# EasyEDA Pro project MSDRV4.eprj, board PCB10
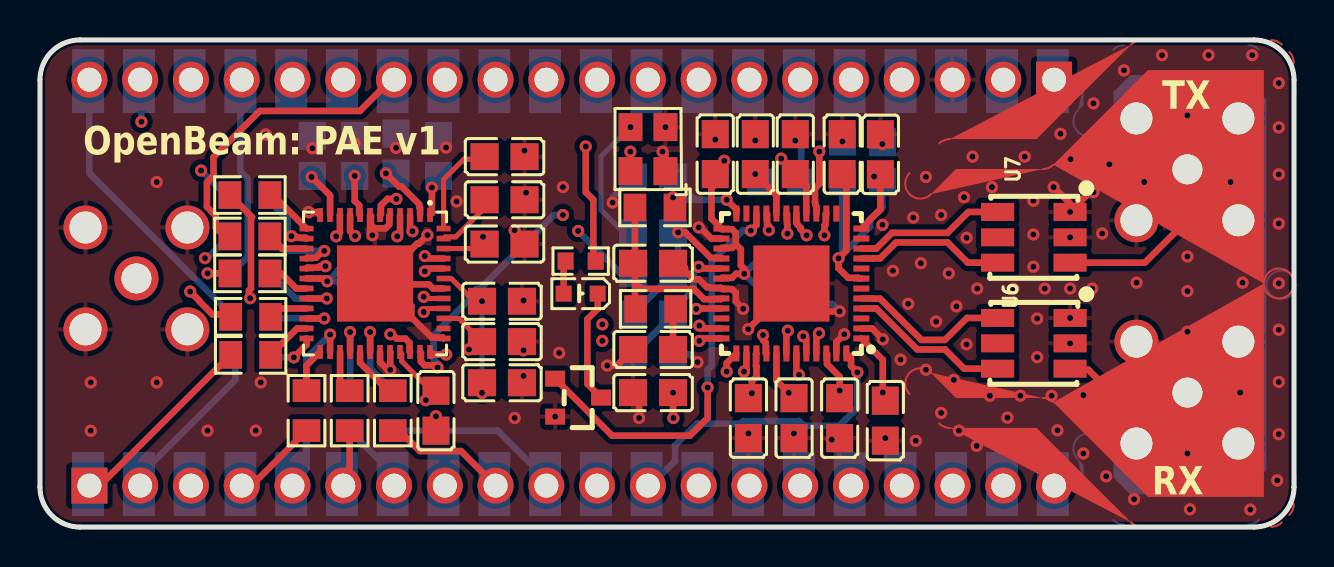
[diagram p4: board, top side]
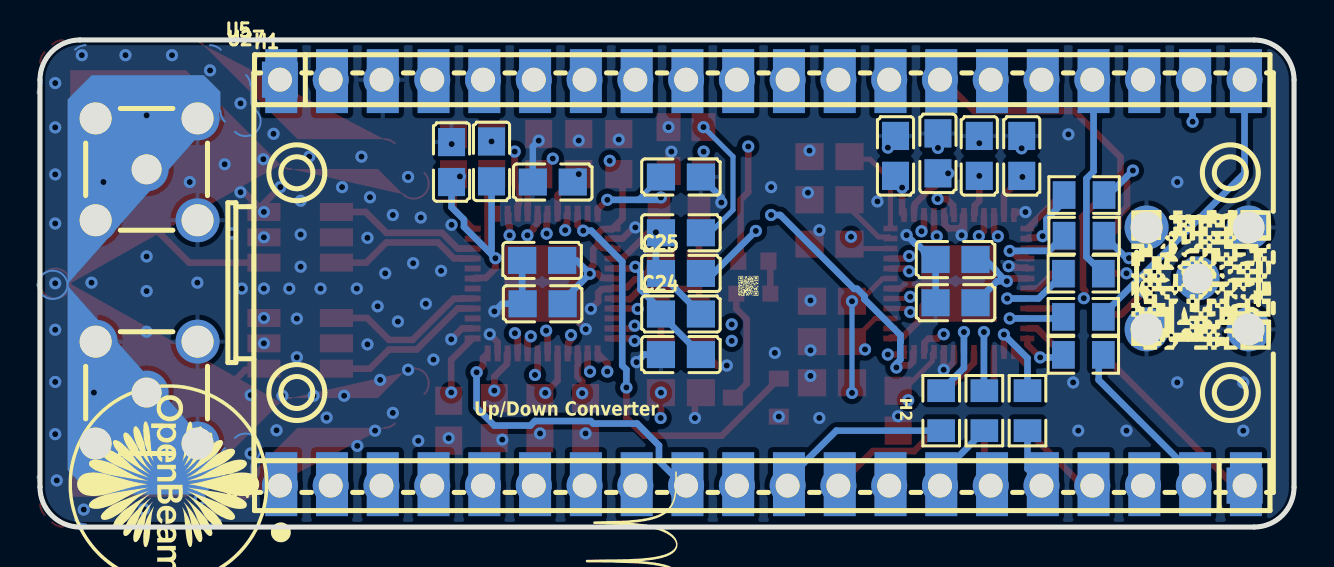
[diagram p5: board, bottom side, seen from below]

Outline 62.74 x 24.38 mm; copper layers: Top Layer, GND, Inner2, Inner3, 3.3, Bottom Layer. Coordinates in mm from the lower left corner of the outline.
Outline path: 0,22.38 0,2 arc(0.59,0.59) 2,0 60.74,0 arc(62.15,0.59) 62.74,2 62.74,22.38 arc(62.15,23.8) 60.74,24.38 2,24.38 arc(0.59,23.8) 0,22.38
Stack: Top Layer 0.035mm Outer layer thickness 1oz / Dielectric1 0.0994mm 3313 RC57% 4.2mil / GND 0.0152mm Inner layer thickness / Dielectric2 0.55mm 0.55mm H/H No copper / Inner2 0.0152mm Inner layer thickness / Dielectric3 0.1088mm 2116 RC54% 4.9mil / Inner3 0.0152mm Inner layer thickness / Dielectric4 0.55mm 0.55mm H/H No copper / 3.3 0.0152mm Inner layer thickness / Dielectric5 0.0994mm 3313 RC57% 4.2mil / Bottom Layer 0.035mm Outer layer thickness 1oz

## Design rules (mm)
net $1I297\RXP: $1I297\RX
net $1I297\RXN: $1I297\RX
net $1I297\TXP: $1I297\TX
net $1I297\TXN: $1I297\TX
net RXQN: RXQ
net RXQP: RXQ
net RXIN: RXI
net RXIP: RXI
net TXQN: TXQ
net TXQP: TXQ
net TXIN: TXI
net TXIP: TXI
template: JLCPCB Capability(Two Layers Board)
spacing copperThickness1oz (default): track to track 0.102, other pairs 0.152 to 0.3
spacing copperThickness2oz: track to track 0.203, other pairs 0.152 to 0.3
track width copperThickness1oz (default): min 0.127, default 0.254, max 2.54
track width copperThickness2oz: min 0.203, default 0.254, max 2.54
differential pair differentialPair (default): width min 0.127, default 0.254, max 2.54; gap min 0.152, default 0.152
via viaSize (default): diameter min 0.5, default 0.61, max 10; hole min 0.3, default 0.305, max 6.3

## Placement (name value [footprint] x y rotation side)
C18  100nF  [C0805]  30.67 6.73 0 top
C19  1nF  [C0805]  30.67 14.73 0 bottom
C20  100pF  [C0805]  30.67 17.52 0 bottom
C21  2200pF  [C0805]  30.67 8.89 0 top
C22  68pF  [C0805]  30.67 13.21 180 top
C23  18pF  [C0805]  30.67 8.63 0 bottom
C24  100nF  [C0805]  30.67 10.67 180 bottom
C25  100nF  [C0805]  30.67 12.7 180 bottom
C26  330nF  [C0805]  19.94 18.58 270 bottom
C28  100nF  [C0805]  23.11 11.3 180 top
C30  100nF  [C0805]  17.81 18.71 90 bottom
C31  100nF  [C0805]  13.62 18.58 270 bottom
C32  100nF  [C0805]  15.75 18.58 270 bottom
C33  100nF  [C0805]  23.11 9.28 0 top
C35  330nF  [C0805]  23.24 18.54 0 top
C36  100nF  [C0805]  23.11 7.22 180 top
C37  330nF  [C0805]  23.24 16.38 180 top
C38  100nF  [C0805]  23.24 14.17 180 top
C39  100nF  [C0805]  16.93 11.23 180 bottom
C40  100nF  [C0805]  19.81 5.83 90 top
C41  100nF  [C0805]  16.93 13.39 180 bottom
CLNA1  100pF  [C0805]  42.29 5.33 270 top
CPA1  10uF  [C0805]  40.15 18.3 90 bottom
CPA2  10uF  [C0805]  42.15 18.27 90 bottom
CPA3  100nF  [C0805]  42.05 18.66 90 top
CPLL1  100pF  [C0805]  37.79 18.67 90 top
CRXMX1  100pF  [C0805]  40.01 5.45 270 top
CTXMX1  100pF  [C0805]  40.13 18.67 90 top
CVCCCP1  10nF  [C0805]  35.78 18.67 90 top
CVCO0  100pF  [C0805]  37.59 11.18 0 bottom
CVCO1  100pF  [C0805]  37.62 13.35 0 bottom
CVCO2  100pF  [C0805]  37.08 17.27 0 bottom
CVRXA1  100pF  [C0805]  35.44 5.45 270 top
CVRXF1  100pF  [C0805]  37.72 5.45 270 top
CVXTAL1  100pF  [C0805]  33.78 18.67 90 top
H1  -  [HDR-TH_20P-P2.54-V-M-1]  26.6 22.39 180 bottom
H2  -  [HDR-TH_20P-P2.54-V-M-1]  26.6 2.07 0 bottom
LED1  -  [LED0603-R-RD]  27.05 11.68 180 top
NOREF  -  [Pad_e387]  53.01 2.87 0 top
NOREF#2  -  [Pad_e1126]  62.1 6.48 0 top
NOREF#3  -  [Pad_e1119]  62.1 17.77 0 top
NOREF#4  -  [Pad_e386]  53.01 21.51 0 top
Q1  -  [SOT-23_L2.9-W1.3-P1.90-LS2.4-BR]  26.92 6.48 180 top
R1  10K  [R0603]  27.05 13.31 0 top
RDA0  100  [R0805]  10.5 16.62 180 top
RDA1  100  [R0805]  10.5 16.62 180 bottom
RDA2  100  [R0805]  10.5 14.54 180 top
U1  MCX5.08-H5  [SMA-TH_MCX5.08-H5]  4.83 12.45 180 bottom
U2  MAX5864ETM+  [QFN-48_L7.0-W7.0-P0.50-BL-EP5.1]  16.76 12.19 180 top
U3  MAX2831ETM+T  [TQFN-48_L7.0-W7.0-P0.50-TL-EP5.6]  37.59 12.19 180 top
U4  MCX5.08-H5  [SMA-TH_MCX5.08-H5]  57.4 6.73 0 bottom
U5  MCX5.08-H5  [SMA-TH_MCX5.08-H5]  57.4 17.91 0 bottom
U6  TCM2-43X+  [IND-SMD_6P-L4.1-W3.8-P1.27-TL]  49.72 9.2 270 top
U7  TCM2-43X+  [IND-SMD_6P-L4.1-W3.8-P1.27-TL]  49.72 14.5 270 top
U8  1.2K  [R0805]  30.8 10.92 0 top
U9  750  [R0805]  30.77 16 0 top
U11  100  [R0805]  17.65 5.83 90 bottom
U12  100  [R0805]  17.65 5.83 90 top
U13  100  [R0805]  15.49 5.83 90 bottom
U14  100  [R0805]  15.49 5.83 90 top
U15  100  [R0805]  13.33 5.83 90 bottom
U16  100  [R0805]  13.33 5.83 90 top
U17  100  [R0805]  10.54 8.62 180 bottom
U18  100  [R0805]  10.54 8.62 180 top
U19  100  [R0805]  10.54 10.52 180 bottom
U20  100  [R0805]  10.54 10.52 180 top
U21  100  [R0805]  10.54 12.68 180 bottom
U22  100  [R0805]  10.5 12.7 180 top
U23  100  [R0805]  10.5 14.59 180 bottom
U27  PICO  [comm-smd_l51.0-w21.0-p2.54_sc0916]  26.22 12.23 180 bottom
X1  40MHz  [OSC-SMD_4P-L3.2-W2.5-BL]  30.42 18.92 90 top

## Footprints (pads in the part's own frame, mm; a bottom-side part is the same pattern mirrored in y, then rotated)
C0805
  rect 1.41x1.35 smd: 1(-1,0) 2(1,0)
comm-smd_l51.0-w21.0-p2.54_sc0916
  rect 1.6x3.2 smd: 1(-24.445,-10.088) 2(-21.905,-10.088) 3(-19.365,-10.088) 4(-16.825,-10.088) 5(-14.285,-10.088) 6(-11.745,-10.088) 7(-9.205,-10.088) 8(-6.665,-10.088) 9(-4.125,-10.088) 10(-1.585,-10.088) 11(0.955,-10.088) 12(3.495,-10.088) 13(6.035,-10.088) 14(8.575,-10.088) 15(11.115,-10.088) 16(13.655,-10.088) 17(16.195,-10.088) 18(18.735,-10.088) 19(21.275,-10.088) 20(23.815,-10.088) 21(23.815,10.088) 22(21.275,10.088) 23(18.735,10.088) 24(16.195,10.088) 25(13.655,10.088) 26(11.115,10.088) 27(8.575,10.088) 28(6.035,10.088) 29(3.495,10.088) 30(0.955,10.088) 31(-1.585,10.088) 32(-4.125,10.088) 33(-6.665,10.088) 34(-9.205,10.088) 35(-11.745,10.088) 36(-14.285,10.088) 37(-16.825,10.088) 38(-19.365,10.088) 39(-21.905,10.088) 40(-24.445,10.088)
HDR-TH_20P-P2.54-V-M-1
  rect 1.8x1.8 hole 1.2: 1(-24.13,0)
  round 1.8 hole 1.2: 2(-21.59,0) 3(-19.05,0) 4(-16.51,0) 5(-13.97,0) 6(-11.43,0) 7(-8.89,0) 8(-6.35,0) 9(-3.81,0) 10(-1.27,0) 11(1.27,0) 12(3.81,0) 13(6.35,0) 14(8.89,0) 15(11.43,0) 16(13.97,0) 17(16.51,0) 18(19.05,0) 19(21.59,0) 20(24.13,0)
IND-SMD_6P-L4.1-W3.8-P1.27-TL
  rect 0.9x1.657 smd: 1(-1.27,1.813) 2(0,1.813) 3(1.27,1.813) 4(1.27,-1.813) 5(0,-1.813) 6(-1.27,-1.813)
LED0603-R-RD
  rect 0.8x0.8 smd: 1(0.851,0) 2(-0.851,0)
OSC-SMD_4P-L3.2-W2.5-BL
  rect 1.4x1.2 smd: 1(-1.1,-0.875) 2(1.1,-0.875) 3(1.1,0.875) 4(-1.1,0.875)
Pad_e386
  custom 19.439x12.93 smd: 50(0,0)
Pad_e387
  custom 19.439x12.93 smd: 51(0,0)
Pad_e1119
  custom 11.152x12.7 smd far side: 52(0,0)
Pad_e1126
  custom 11.152x12.7 smd far side: 53(0,0)
QFN-48_L7.0-W7.0-P0.50-BL-EP5.1
  rect 0.28x0.7 smd: 1(-2.75,-3.428) 2(-2.25,-3.428) 3(-1.75,-3.428) 4(-1.25,-3.428) 5(-0.75,-3.428) 6(-0.25,-3.428) 7(0.25,-3.428) 8(0.75,-3.428) 9(1.25,-3.428) 10(1.75,-3.428) 11(2.25,-3.428) 12(2.75,-3.428) 25(2.75,3.428) 26(2.25,3.428) 27(1.75,3.428) 28(1.25,3.428) 29(0.75,3.428) 30(0.25,3.428) 31(-0.25,3.428) 32(-0.75,3.428) 33(-1.25,3.428) 34(-1.75,3.428) 35(-2.25,3.428) 36(-2.75,3.428)
  rect 0.7x0.28 smd: 13(3.428,-2.75) 14(3.428,-2.25) 15(3.428,-1.75) 16(3.428,-1.25) 17(3.428,-0.75) 18(3.428,-0.25) 19(3.428,0.25) 20(3.428,0.75) 21(3.428,1.25) 22(3.428,1.75) 23(3.428,2.25) 24(3.428,2.75) 37(-3.428,2.75) 38(-3.428,2.25) 39(-3.428,1.75) 40(-3.428,1.25) 41(-3.428,0.75) 42(-3.428,0.25) 43(-3.428,-0.25) 44(-3.428,-0.75) 45(-3.428,-1.25) 46(-3.428,-1.75) 47(-3.428,-2.25) 48(-3.428,-2.75)
  rect 3.81x3.81 smd: 49(0,0)
R0603
  rect 0.806x0.864 smd: 1(-0.753,0) 2(0.753,0)
R0805
  rect 1.133x1.377 smd: 1(-1,0) 2(1,0)
SMA-TH_MCX5.08-H5
  round 2.2 hole 1.6: 1(-2.55,-2.55) 2(-2.55,2.55) 3(2.55,2.55) 4(2.55,-2.55)
  round 2.2 hole 1.5: 5(0,0)
SOT-23_L2.9-W1.3-P1.90-LS2.4-BR
  rect 1x0.8 smd: 1(1.15,-0.95) 2(1.15,0.95) 3(-1.15,0)
TQFN-48_L7.0-W7.0-P0.50-TL-EP5.6
  rect 0.8x0.3 smd: 1(-3.5,2.751) 2(-3.5,2.251) 3(-3.5,1.75) 4(-3.5,1.251) 5(-3.5,0.75) 6(-3.5,0.252) 7(-3.5,-0.249) 8(-3.5,-0.75) 9(-3.5,-1.25) 10(-3.5,-1.75) 11(-3.5,-2.249) 12(-3.5,-2.748) 25(3.5,-2.748) 26(3.5,-2.249) 27(3.5,-1.75) 28(3.5,-1.25) 29(3.5,-0.75) 30(3.5,-0.249) 31(3.5,0.252) 32(3.5,0.75) 33(3.5,1.251) 34(3.5,1.75) 35(3.5,2.251) 36(3.5,2.751)
  rect 0.3x0.8 smd: 13(-2.751,-3.5) 14(-2.251,-3.5) 15(-1.75,-3.5) 16(-1.25,-3.5) 17(-0.75,-3.5) 18(-0.251,-3.5) 19(0.249,-3.5) 20(0.75,-3.5) 21(1.25,-3.5) 22(1.75,-3.5) 23(2.251,-3.5) 24(2.751,-3.5) 37(2.751,3.5) 38(2.251,3.5) 39(1.75,3.5) 40(1.25,3.5) 41(0.75,3.5) 42(0.251,3.5) 43(-0.251,3.5) 44(-0.75,3.5) 45(-1.25,3.5) 46(-1.75,3.5) 47(-2.251,3.5) 48(-2.751,3.5)
  rect 3.81x3.81 smd: 49(0,0.001)

## Nets
+5V: H1.1 R1.2 U27.40
GND: C18.1 C20.1 C21.1 C22.1 C23.2 C26.1 C28.1 C30.2 C31.1 C32.1 C33.2 C35.2 C36.1 C37.1 C38.1 C39.1 C40.1 C41.1 CLNA1.2 CPA1.2 CPA2.2 CPA3.2 CPLL1.2 CRXMX1.2 CTXMX1.2 CVCCCP1.2 CVCO0.2 CVCO1.2 CVCO2.2 CVRXA1.2 CVRXF1.2 CVXTAL1.2 H1.3 NOREF.51 NOREF#2.53 NOREF#3.52 NOREF#4.50 Q1.2 U1.1 U1.2 U1.3 U1.4 U2.5 U2.7 U2.12 U2.17 U2.31 U2.32 U2.37 U2.42 U2.49 U3.2 U3.26 U3.31 U3.47 U3.49 U4.1 U4.2 U4.3 U4.4 U5.1 U5.2 U5.3 U5.4 U6.1 U6.2 U7.1 U7.2 U27.38 X1.1 X1.2
3.3: C28.2 C30.1 C31.2 C32.2 C33.1 C36.2 C38.2 C39.2 C40.2 C41.2 CLNA1.1 CPA1.1 CPA2.1 CPA3.1 CPLL1.1 CRXMX1.1 CTXMX1.1 CVCCCP1.1 CVCO0.1 CVCO1.1 CVCO2.1 CVRXA1.1 CVRXF1.1 CVXTAL1.1 H1.5 U2.2 U2.8 U2.11 U2.18 U2.33 U2.39 U2.43 U2.46 U3.1 U3.7 U3.12 U3.13 U3.17 U3.20 U3.25 U3.27 U3.30 U3.39 U3.40 U3.41 U3.46 U27.36 X1.4
$1I61\$1N1602: C37.2 U2.47
$1I61\$1N1605: U2.30 U11.2
$1I61\$1N1608: U2.29 U12.2
$1I61\$1N1611: U2.28 U13.2
$1I61\$1N1614: U2.27 U14.2
$1I61\$1N1617: U2.26 U15.2
$1I61\$1N1620: U2.25 U16.2
$1I61\$1N1625: U2.24 U17.1
$1I61\$1N1628: U2.23 U18.1
$1I61\$1N1633: U2.21 U20.1
$1I61\$1N1636: U2.20 U21.1
$1I61\$1N1639: U2.19 U22.1
$1I61\$1N1642: U2.16 U23.1
$1I61\$1N1645: RDA2.1 U2.15
$1I61\$1N1648: RDA1.1 U2.14
$1I61\$1N1651: RDA0.1 U2.13
$1I61\$1N1653: C35.1 U2.48
$1I61\$1N1654: C26.2 U2.1
$1I61\$1N1662: U2.22 U19.1
$1I297\$1N1513: U4.5 U6.3
$1I297\$1N1514: U5.5 U7.3
$1I297\$1N1515: C21.2 U8.2
$1I297\$1N2254: C23.1 C24.1 U3.29
$1I297\$1N2490: C19.1 X1.3
$1I297\BYPASS: C18.2 U3.33
$1I297\CPOUT: C20.2 U3.24 U9.2
$1I297\D1: U3.23
$1I297\D2: U3.11
$1I297\D3: U3.8
$1I297\D4: U3.34
$1I297\D5: U3.14
$1I297\D6: U3.3
$1I297\D7: U3.6
$1I297\RXN: U3.5 U6.6
$1I297\RXP: U3.4 U6.4
$1I297\TUNE: C22.2 U3.32 U8.1 U9.1
$1I297\TXN: U3.10 U7.6
$1I297\TXP: U3.9 U7.4
$1I297\XTAL: C19.2 C24.2 C25.1 U3.28
BBC_CLK: H1.10 U2.6 U27.31
BBC_DA0: H2.11 RDA0.2 U27.10
BBC_DA1: H1.12 RDA1.2 U27.29
BBC_DA2: H1.14 RDA2.2 U27.27
BBC_DA3: H1.15 U23.2 U27.26
BBC_DA4: H1.16 U22.2 U27.25
BBC_DA5: H1.17 U21.2 U27.24
BBC_DA6: H1.19 U20.2 U27.22
BBC_DA7: H1.20 U19.2 U27.21
BBC_DD0: H2.1 U18.2 U27.20
BBC_DD1: H2.2 U17.2 U27.19
BBC_DD2: H2.4 U16.1 U27.17
BBC_DD3: H2.5 U15.1 U27.16
BBC_DD4: H2.6 U14.1 U27.15
BBC_DD5: H2.7 U13.1 U27.14
BBC_DD6: H2.9 U12.1 U27.12
BBC_DD7: H2.10 U11.1 U27.11
RXIN: U2.4 U3.37
RXIP: U2.3 U3.38
RXQN: U2.9 U3.35
RXQP: U2.10 U3.36
TXIN: U2.44 U3.44
TXIP: U2.45 U3.45
TXQN: U2.41 U3.42
TXQP: U2.40 U3.43
$1N2356: H2.3 U27.18
$1N2366: H2.8 U27.13
$1N2372: H2.13 U27.8
$1N2374: H2.18 U27.3
$1N2378: H1.2 U27.39
$1N2382: H1.4 U27.37
$1N2386: H1.6 U27.35
$1N2388: H1.7 U3.16 U27.34
$1N2390: H1.8 U27.33
$1N2392: C25.2 H1.9 U1.5 U27.32
$1N2396: H1.11 U27.30
$1N2400: H1.13 U27.28
$1N2410: H1.18 U27.23
$1N2418: H2.12 U3.48 U27.9
$1N2420: H2.14 U3.21 U27.7
$1N2424: H2.16 U2.34 U3.19 U27.5
$1N2426: H2.17 U2.35 U3.18 U27.4
$1N2428: H2.19 U2.36 U27.2
$1N2430: H2.20 U3.15 U27.1
$1N4492: Q1.1 U3.22
$1N4497: H2.15 U27.6
$1N4593: LED1.2 Q1.3
$1N4646: LED1.1 R1.1

Pads without a net: U2 38; U6 5; U7 5

## Via types
v1: diameter 0.61, hole 0.305, Top Layer to Bottom Layer, 205 vias

## Routing (per net, layer and track width the routed paths; a pad name or vN(x,y) marks a point on that pad's centre or on a via; arc(x,y) is an arc through that point)
+5V: length 30.8
  Top Layer w0.33: 27.8,13.44 27.69,13.56 27.69,16.38 27.31,16.76 v1(27.31,19.05)
  Inner2 w0.33: H1.1 48.79,20.45 31.75,20.45 31.55,20.64 29.29,20.64 29.09,20.45 28.7,20.45 v1(27.31,19.05)
GND: length 55.3
  Top Layer w0.33: U2.49 16.96,12.19 18.5,13.73 18.5,13.82 18.87,14.19 18.96,14.19 v1(19.39,14.61) ; 30.86,17.39 X1.1 31.29,18.65 v1(31.15,18.79) ; U2.5 17.49,15.59 17.49,15.48 17.47,15.47 17.47,15.14 17.29,14.95 16.74,14.95 16.56,15.14 16.56,15.58 U2.7 16.51,14.72 v1(16.63,14.61) ; v1(35.18,10.92) 34.81,11.29 34.81,11.72 34.62,11.91 34.19,11.91 34.16,11.94 U3.31 34.06,11.97 33.56,11.97 33.53,12 33.37,12 32.96,12.41 32.69,12.41 32.27,12.83 32.27,12.98 31.97,13.27 31.74,13.27 C22.1 ; U3.26 33.59,14.44 33.03,15 v1(32.95,15) ; U2.17 13.38,12.98 13.93,12.98 14,13.06 v1(14.28,13.06) ; U2.31 17.01,8.26 17.4,7.87 v1(17.53,7.87) 17.53,8.75 U2.32 ; v1(50.71,17.02) 51.54,16.2 v1(51.54,15.77) 52.53,16.76 v1(52.7,16.76) ; U2.12 13.87,15.77 v1(13.44,15.77) ; U3.2 41.62,9.94 v1(42.16,9.4) ; C40.1 v1(19.81,5.55) ; v1(28.38,8.09) 28.87,8.09 C21.1 ; U2.42 19.66,11.94 19.46,12.15 17.49,12.15 18.58,11.05 18.58,10.51 19.6,9.48 20.15,9.48 U2.37 ; v1(23.75,14.86) 24.24,14.36 C38.1 ; v1(40.23,9.65) 39.84,9.26 U3.47 ; v1(24.32,16.74) 24.32,16.46 C37.1 ; v1(29.97,5.46) 29.97,6.43 C18.1 ; v1(35.43,9.91) 37.59,12.06 U3.49 38.99,10.8 v1(40,10.8)
  Bottom Layer w0.33: v1(28.65,16.24) 28.65,16.5 C20.1 ; C23.2 32.51,8.63 v1(32.89,8.25) ; v1(37.79,19.34) 38.08,19.05 CVCO2.2 ; CVCO1.2 38.62,11.2 CVCO0.2 39.62,11.18 v1(40,10.8) ; v1(19.39,14.61) 18.96,14.19 18.87,14.19 18.5,13.82 18.5,13.73 18.16,13.39 C41.1 C39.1
  vias: v1(2.54,7.24) v1(2.54,4.82) v1(5.84,17.27) v1(5.84,7.24) v1(8.38,4.83) v1(10.8,4.83) v1(11.05,7.24) v1(11.29,19.66) v1(13.63,18.96) v1(15.75,19.21) v1(17.81,18.98) v1(20.32,18.99) v1(20.84,16.3) v1(23.75,5.46) v1(24.19,11.34) v1(24.19,8.85) v1(24.19,7.57) v1(24.24,18.85) v1(25.77,5.53) v1(25.97,8.72) v1(26.16,17.02) v1(31.29,20.02) v1(33.78,19.4) v1(35.44,4.69) v1(35.78,19.35) v1(37.72,4.69) v1(39.61,4.37) v1(40.15,19.3) v1(42.14,19.17) v1(42.15,15.13) v1(42.29,4.45) v1(42.67,12.83) v1(43.05,8.38) v1(43.43,11.18) v1(43.69,15.49) v1(43.81,4.32) v1(44.07,13.21) v1(44.32,17.53) v1(44.32,7.87) v1(44.83,10.29) v1(45.09,15.62) v1(45.09,5.72) v1(45.47,12.7) v1(45.72,7.37) v1(45.85,11.05) v1(45.97,4.83) v1(46.23,16.51) v1(46.35,14.48) v1(46.35,9.14) v1(46.65,18.54) v1(46.89,11.94) v1(46.86,4.06) v1(47.52,6.57) v1(47.62,17.02) v1(48.4,5.48) v1(48.7,11.94) v1(49.05,6.57) v1(49.27,18.54) v1(49.7,16.33) v1(49.7,14.64) v1(49.7,13.03) v1(49.89,10.44) v1(49.89,8.5) v1(50.27,11.94) v1(50.61,6.57) v1(50.9,4.84) v1(51.05,19.69) v1(51.56,18.41) v1(51.54,14.5) v1(51.54,11.94) v1(51.54,10.47) v1(51.54,9.2) v1(52.2,6.6) v1(52.2,3.68) v1(52.7,21.21) v1(52.64,11.94) v1(53.14,14.7) v1(53.34,2.54) v1(53.5,18.16) v1(54.23,22.86) v1(54.74,1.4) v1(54.86,12.23) v1(55.25,17.27) v1(56.13,23.62) v1(57.4,20.61) v1(57.4,13.55) v1(57.4,11.81) v1(57.4,9.78) v1(57.4,3.68) v1(57.53,0.89) v1(58.46,23.62) v1(59.56,17.27) v1(60.04,6.73) v1(60.16,12.23) v1(60.55,0.88) v1(60.65,23.62) v1(61.9,2.33) v1(61.98,22.22) v1(61.98,20.01) v1(61.98,17.65) v1(61.98,15.19) v1(61.98,12.2) v1(61.98,9.88) v1(61.98,7.26) v1(61.98,4.65)
3.3: length 73.5
  Top Layer w0.254: v1(22.11,11.3) 22.11,11.34 21.67,11.34 20.58,12.44 U2.43 ; 21.58,13.94 U2.46 ; U2.33 18.09,8.68 18.09,8.3 19.57,6.83 C40.2 ; C33.1 20.95,10.44 U2.39
  Top Layer w0.33: U3.46 39.38,8.66 39.38,8.16 40.01,7.53 v1(40.01,6.83) CRXMX1.1 ; v1(13.59,17.53) 14.51,16.6 U2.11 ; v1(17.31,17.71) 17.96,17.05 18.09,17.05 18.97,16.17 18.97,16.04 19.01,16 U2.2 ; CVRXA1.1 35.44,6.53 v1(35.61,6.7) 35.61,7.3 35.84,7.52 35.84,8.04 35.82,8.06 35.82,8.67 U3.39 ; v1(42.16,6.74) 42.16,8.37 U3.1 ; CPA3.1 42.05,15.89 41.9,15.75 41.89,15.75 41.53,15.39 41.53,15.37 U3.12 ; U3.27 34.12,13.97 34.62,13.97 34.81,14.16 ; U2.8 15.97,15.66 15.97,16.1 15.75,16.33 v1(15.75,17.58) ; CPLL1.1 38.34,17.11 U3.17 ; U3.40 36.31,8.72 36.31,9.22 36.17,9.36 v1(36.17,9.61) ; 34.81,14.16 34.81,14.72 34.62,14.91 34.12,14.91 U3.25 33.59,15.44 33.59,16.97 34.29,17.67 ; 34.81,14.16 35.06,13.91 35.06,13.1 35.23,12.93 v1(35.23,12.68) 34.83,12.68 34.62,12.47 34.13,12.47 34.09,12.44 ; U2.18 14.02,12.44 14.02,12.44 14.23,12.44 v1(14.37,12.3) ; U3.20 36.84,16.61 v1(35.78,17.67) ; CTXMX1.1 40.34,17.46 U3.13 40.34,13.85 v1(39.95,13.46) 39.95,13.45 39.95,12.96 40.43,12.47 40.93,12.47 40.97,12.44 41.09,12.44 ; CVRXF1.1 v1(37.46,6.72) 36.84,7.33 U3.41 ; v1(29.54,18.79) 29.54,18.79 X1.4
  Bottom Layer w0.254: v1(22.11,6.71) v1(22.11,11.3)
  Bottom Layer w0.33: C39.2 14.86,12.3 v1(14.37,12.3) 14.5,12.44 14.53,12.44 14.9,12.8 14.9,12.84 15.45,13.39 C41.2 ; v1(13.59,17.53) 13.62,17.56 C31.2 ; CVCO0.1 36.59,11.32 v1(35.23,12.68) 35.9,13.35 CVCO1.1 ; CPA1.1 40.15,13.65 ; 40.15,13.65 v1(39.95,13.46) ; 40.15,13.65 41.53,15.03 41.53,15.39 42.15,16.01 CPA2.1 ; 41.89,17.39 42.15,17.65
  vias: v1(19.3,6.35) v1(21.46,8.89) v1(22.16,14.53) v1(34.23,18.33) v1(37.08,18.44) v1(41.73,17.55)
$1I61\$1N1602: length 3.1
  Top Layer w0.254: C37.2 22.11,16.26 22.11,15.85 20.79,14.52 20.27,14.52 U2.47
$1I61\$1N1605: length 4.4
  Top Layer w0.33: U2.30 v1(16.51,9.76)
  Bottom Layer w0.33: v1(16.51,9.76) 16.51,7.96 U11.2
$1I61\$1N1608: length 2.8
  Top Layer w0.33: U12.2 17.41,6.83 16.01,8.22 U2.29
$1I61\$1N1611: length 3.9
  Top Layer w0.33: U2.28 v1(15.51,9.76)
  Bottom Layer w0.33: v1(15.51,9.76) 15.51,6.85 U13.2
$1I61\$1N1614: length 2.1
  Top Layer w0.33: U14.2 15.01,7.3 U2.27
$1I61\$1N1617: length 4.2
  Top Layer w0.33: U2.26 v1(14.51,9.63)
  Bottom Layer w0.33: U15.2 13.33,8.45 v1(14.51,9.63)
$1I61\$1N1620: length 2.2
  Top Layer w0.33: U2.25 13.33,8.08 U16.2
$1I61\$1N1625: length 2.4
  Top Layer w0.33: v1(12.7,8.49) 13.34,9.13 U2.24
  Bottom Layer w0.33: v1(12.7,8.49) 11.67,8.49 U17.1
$1I61\$1N1628: length 2.3
  Top Layer w0.33: U2.23 12.86,9.94 U18.1
$1I61\$1N1633: length 1.9
  Top Layer w0.33: U2.21 11.83,10.94 11.54,10.65
$1I61\$1N1636: length 4.3
  Top Layer w0.33: U2.20 v1(14.35,11.44)
  Bottom Layer w0.33: v1(14.35,11.44) 12.78,11.44 U21.1
$1I61\$1N1639: length 2.1
  Top Layer w0.33: U2.19 12.82,11.94 12.06,12.7 U22.1
$1I61\$1N1642: length 4.1
  Top Layer w0.33: v1(14.22,13.82) 14.16,13.82 13.82,13.48 13.38,13.48 U2.16
  Bottom Layer w0.33: U23.1 12.27,13.82 v1(14.22,13.82)
$1I61\$1N1645: length 2.1
  Top Layer w0.33: U2.15 12.11,13.94 RDA2.1
$1I61\$1N1648: length 3.3
  Top Layer w0.33: v1(12.58,14.56) 12.78,14.56 12.85,14.48 13.29,14.48 U2.14
  Bottom Layer w0.33: RDA1.1 11.5,16.29 12.39,15.41 12.39,14.75 v1(12.58,14.56)
$1I61\$1N1651: length 2.5
  Top Layer w0.33: U2.13 11.66,16.62 RDA0.1
$1I61\$1N1653: length 4.9
  Top Layer w0.254: 22.24,18.41 21.21,18.41 20.19,17.4 U2.48
$1I61\$1N1654: length 1.4
  Top Layer w0.33: v1(19.61,16.99) 19.61,15.71 U2.1
$1I61\$1N1662: length 3.7
  Top Layer w0.33: U2.22 v1(14.22,10.44)
  Bottom Layer w0.33: v1(14.22,10.44) 11.75,10.44 11.54,10.65
$1I297\$1N1513: length 6.4
  Top Layer w0.33: U6.3 51.59,7.87 52.45,7.87 53.59,6.73 U4.5
$1I297\$1N1514: length 9.5
  Top Layer w0.33: U5.5 57.66,17.65 57.66,15.62 55.27,13.23 U7.3
$1I297\$1N1515: length 2.2
  Top Layer w0.33: 31.67,11.05 C21.2
$1I297\$1N2254: length 6.9
  Top Layer w0.33: U3.29 33.04,12.94 v1(32.95,13.03)
  Bottom Layer w0.33: C23.1 31.67,10.63 C24.1 31.67,10.87 32.69,11.89 32.69,12.77 v1(32.95,13.03)
$1I297\$1N2490: length 6.8
  Bottom Layer w0.254: v1(29.54,20.02) 28.07,18.54 28.07,15.88 29.21,14.73 C19.1
$1I297\BYPASS: length 7.2
  Top Layer w0.33: v1(31.67,6.73) 31.67,5.47 v1(31.69,5.46) ; 34.09,10.94 32.86,10.94 v1(32.83,10.92)
  Inner2 w0.33: v1(31.67,6.73) 31.67,9.76 v1(32.83,10.92)
$1I297\CPOUT: length 6.2
  Top Layer w0.33: 31.77,15.62 31.67,15.71 v1(31.67,16.5) ; v1(34.35,16.38) 34.84,15.89 34.84,15.69
  Bottom Layer w0.254: 32.81,16.38 C20.2
  Bottom Layer w0.33: v1(34.35,16.38) 31.79,16.38 v1(31.67,16.5)
$1I297\RXN: length 8.1
  Top Layer w0.33: U3.5 41.66,11.44 41.67,11.43 42.03,11.43 44.09,9.37 45.28,9.37 46.37,10.47 U6.6
$1I297\RXP: length 8.1
  Top Layer w0.33: U6.4 46.24,7.93 45.28,8.89 43.89,8.89 41.83,10.95 41.67,10.95 41.66,10.94 41.09,10.94
$1I297\TUNE: length 9.3
  Top Layer w0.33: 29.77,12.26 30.1,11.92 32.71,11.92 33.22,11.41 34.06,11.41 U3.32 ; 29.77,12.26 29.77,15.62 ; 29.77,12.26 29.77,11.14 29.67,11.05
$1I297\TXN: length 7.6
  Top Layer w0.33: U7.6 46.45,15.77 45.4,14.73 42.63,14.73 41.83,13.93 41.67,13.93 41.66,13.94 U3.10
$1I297\TXP: length 7.6
  Top Layer w0.33: U7.4 46.42,13.23 45.4,14.25 42.83,14.25 42.03,13.45 41.67,13.45 41.66,13.44 U3.9
$1I297\XTAL: length 7.7
  Top Layer w0.33: U3.28 34.06,13.47 33.56,13.47 32.28,14.76 v1(31.93,14.76)
  Bottom Layer w0.33: C24.2 31.67,12.67 C25.1 31.93,12.95 v1(31.93,14.76)
BBC_CLK: length 13.9
  Top Layer w0.33: v1(17.83,16.43) 17.38,16.43 17.06,16.1 17.06,15.66 U2.6
  Inner2 w0.33: H1.10 25.29,19.81 22.02,19.81 20.36,18.16 19.69,18.16 17.95,16.43 v1(17.83,16.43)
BBC_DA0: length 27
  Top Layer w0.33: RDA0.2 10.6,15.52 10.6,15.48 10.56,15.43 10.56,11.94 10.45,11.84 10.45,11.52 v1(10.52,11.46)
  Inner3 w0.33: H2.11 27.05,2.07 25.84,3.29 18.78,3.29 10.61,11.46 v1(10.52,11.46)
BBC_DA1: length 19.6
  Inner3 w0.33: H1.12 22.79,20.59 20.55,18.34 18.7,18.34 18.68,18.33 8.54,18.33 v1(8.06,17.85)
  Bottom Layer w0.33: RDA1.2 9.29,16.62 v1(8.06,17.85)
BBC_DA2: length 15.8
  Top Layer w0.33: RDA2.2 9.38,14.67 9.12,14.67 8.79,15 8.79,15.58 8.35,16.02 8.35,17.26 8.68,17.59 8.68,18.52 10.99,20.83 16,20.83 17.08,21.9 17.08,22.39 17.21,22.52 17.59,22.52 H1.14
BBC_DA3: length 13.9
  Inner2 w0.33: H1.15 9.78,17 9.78,14.35 8.89,13.46 v1(8.25,13.46)
  Bottom Layer w0.33: v1(8.25,13.46) 8.38,13.46 U23.2
BBC_DA4: length 15.6
  Top Layer w0.33: v1(8.38,12.7) U22.2
  Inner3 w0.33: H1.16 11.07,20.83 9.27,20.83 6.98,18.54 6.98,17.39 9.4,14.98 9.4,13.72 v1(8.38,12.7)
BBC_DA5: length 10.1
  Bottom Layer w0.33: U27.24 10.03,17.8 10.39,17.44 10.39,13.53 U21.2
BBC_DA6: length 14.1
  Top Layer w0.33: 9.54,10.65 8.62,10.65 7.96,11.31 7.96,11.34 v1(7.52,11.79)
  Inner3 w0.33: v1(5.07,20.29) 5.07,14.86 7.52,12.42 v1(7.52,11.79)
  Bottom Layer w0.33: U27.22 5.07,22.19 v1(5.07,20.29)
BBC_DA7: length 14.7
  Bottom Layer w0.33: 9.54,10.65 2.47,17.72 H1.20
BBC_DD0: length 9.8
  Top Layer w0.33: U18.2 2.99,2.07 H2.1
BBC_DD1: length 8.6
  Bottom Layer w0.33: U17.2 9.77,8.39 9.77,7.37 4.95,2.54 4.95,2.15
BBC_DD2: length 4.4
  Top Layer w0.33: H2.4 10.58,2.07 U16.1
BBC_DD3: length 3
  Bottom Layer w0.33: U15.1 13.33,2.91 12.57,2.15
BBC_DD4: length 2.9
  Top Layer w0.33: U14.1 15.49,2.39 H2.6
BBC_DD5: length 3.6
  Bottom Layer w0.33: 17.65,2.15 17.65,2.67 U13.1
BBC_DD6: length 6.3
  Top Layer w0.33: U12.1 17.98,4.83 19,3.8 21.06,3.8 H2.9
BBC_DD7: length 9
  Bottom Layer w0.33: H2.10 25.33,2.39 22.9,4.83 U11.1
RXIN: length 27.3
  Top Layer w0.33: v1(17.87,14.55) 18.01,14.69 U2.4 ; v1(34.35,7.78) 34.35,8.21 34.84,8.69
  Inner3 w0.33: v1(34.35,7.78) 34.35,8.29 34.55,8.48 34.55,8.81 34.02,9.34 34.02,10.62 33.09,11.54 27.92,11.54 25.92,9.53 18.66,9.53 17.87,10.32 v1(17.87,14.55)
RXIP: length 27
  Top Layer w0.33: v1(35.22,7.78) 35.34,7.9 U3.38 ; v1(18.64,14.81) 18.51,14.93 U2.3
  Inner3 w0.33: v1(35.22,7.78) 35.22,8.42 35.03,8.61 35.03,9.14 34.5,9.67 34.5,10.97 33.44,12.02 27.6,12.02 25.72,10.14 18.86,10.14 18.5,10.51 18.5,13.78 18.5,13.79 18.5,13.84 18.64,13.97 v1(18.64,14.81)
RXQN: length 22.6
  Top Layer w0.33: U2.9 15.51,14.82 v1(15.77,14.57) ; U3.35 33.13,9.94 v1(32.99,10.08)
  Inner2 w0.33: v1(28.13,10.15) 27.37,10.15 27.23,10.01 ; 27.23,10.01 21.02,10.01 20.89,9.88 19.02,9.88 15.77,13.13 v1(15.77,14.57) ; 27.23,10.01 27.31,10.01
  Inner3 w0.33: v1(28.13,10.15) 28.34,9.94 32.21,9.94 32.35,10.08 v1(32.99,10.08)
RXQP: length 23.6
  Top Layer w0.33: U3.36 33.11,9.44 v1(32.99,9.32) ; v1(14.82,14.55) 15,14.74 15,15.61 U2.10
  Inner2 w0.33: v1(28.13,9.32) 27.56,9.32 27.36,9.52 21.34,9.52 21.33,9.51 21.21,9.51 21.09,9.4 18.82,9.4 15.24,12.98 15.24,13.83 14.76,14.31 14.76,14.44 14.82,14.49 v1(14.82,14.55)
  Inner3 w0.33: v1(28.13,9.32) 28.27,9.46 32.21,9.46 32.35,9.32 v1(32.99,9.32)
TXIN: length 22.6
  Top Layer w0.33: U2.44 19.39,12.94 v1(19.25,12.8) ; v1(38.18,9.55) 38.34,9.39 U3.44
  Inner2 w0.33: v1(19.25,12.8) 19.27,12.78 19.61,12.78 19.79,12.95 25.15,12.95 26.54,11.56 34.64,11.56 34.64,11.55 35.56,11.55 35.56,11.56 36.64,11.56 38.18,10.02 v1(38.18,9.55)
TXIP: length 23.7
  Top Layer w0.33: U3.45 38.84,9.57 v1(38.98,9.7) ; U2.45 19.38,13.44 v1(19.25,13.56)
  Inner2 w0.33: v1(38.98,9.7) 38.85,9.83 38.85,10.3 37.1,12.04 26.74,12.04 25.35,13.44 19.38,13.44 v1(19.25,13.56)
TXQN: length 25.4
  Top Layer w0.254: U2.41 19.28,11.44 v1(19.2,11.53)
  Top Layer w0.33: U3.42 37.34,9.76 v1(37.42,9.83)
  Inner3 w0.33: v1(19.2,11.53) 20.32,11.53 22.93,14.13 35.94,14.13 37.98,12.09 37.98,10.52 37.42,9.96 v1(37.42,9.83)
TXQP: length 27
  Top Layer w0.254: U2.40 19.38,10.94 v1(19.2,10.76)
  Top Layer w0.33: v1(37.97,7.61) 37.84,7.74 U3.43
  Inner3 w0.33: v1(19.2,10.76) 20.75,10.76 21.3,11.32 21.3,11.37 21.86,11.92 21.91,11.92 23.63,13.65 35.14,13.65 35.85,12.94 35.85,12.9 36.79,11.96 36.79,9.32 37.15,8.97 37.15,7.93 37.66,7.42 37.78,7.42 v1(37.97,7.61)
$1N2388: length 8.3
  Top Layer w0.33: v1(38.99,18.8) 38.99,17.17 38.78,16.96 arc(38.78,16.93) 38.77,16.91 38.77,16.24 arc(38.8,16.17) 38.81,16.09 38.84,16.06 U3.16
  Inner3 w0.33: v1(38.99,18.8) 38.99,18.9 38.41,19.48 38.41,19.6 38.04,19.97 37.92,19.97 H1.7
$1N2392: length 27.6
  Inner2 w0.33: v1(26.92,14.82) 26.75,15 25.9,15 25.54,15.37 24.12,15.37 24,15.48 18.43,15.48 18.32,15.37 17.53,15.37 17.52,15.36 14.25,15.36 10.97,12.08 8.12,12.08 7.76,12.45 U1.5
  Bottom Layer w0.33: v1(26.92,14.82) 29.05,12.7 C25.2
$1N2418: length 15.7
  Top Layer w0.33: v1(40.89,7.75) 40.58,8.06 40.58,8.46 U3.48
  Bottom Layer w0.33: v1(40.89,7.75) 40.89,5.97 40,5.08 38.21,5.08 37.98,5.31 35.18,5.31 35.06,5.18 32.87,5.18 31.77,4.08 31.77,3.3 30.54,2.07 H2.12
$1N2420: length 17
  Top Layer w0.33: v1(36.46,14.86) 36.46,15.07 36.38,15.16 36.38,15.66 U3.21
  Inner3 w0.33: v1(36.46,14.86) 36.77,14.55 36.77,14.43 39.24,11.96 39.24,10.33 39.6,9.96 39.6,7.3 39.39,7.09 39.39,5.47 37.98,4.06 37.48,4.06 H2.14
$1N2424: length 57.7
  Top Layer w0.33: v1(37.39,14.69) 37.39,15.15 37.38,15.16 37.38,15.66 U3.19 ; v1(17.53,9.65) 17.63,9.65 17.85,9.43 18.29,9.43 18.49,9.23 18.49,8.79 U2.34
  Inner2 w0.33: v1(17.53,9.65) 17.53,9.01 22.47,4.06 38.58,4.06 H2.16
  Inner3 w0.33: v1(37.39,14.69) 37.39,14.82 34.68,17.53 34.16,17.53 33.83,17.86 19.59,17.86 18.99,17.25 18.99,16.54 17.25,14.81 17.25,9.93 v1(17.53,9.65)
$1N2426: length 52.2
  Top Layer w0.33: v1(38.35,14.6) 38.06,14.9 38.06,14.97 37.87,15.16 37.87,15.21 37.84,15.24 U3.18 ; U2.35 19.06,8.72 19.06,8.28 19.24,8.1 19.68,8.1 19.79,7.99 v1(19.89,7.99)
  Inner2 w0.33: v1(38.35,14.6) 37.34,15.62 v1(26.16,15.62) ; v1(19.89,7.99) 23.04,4.84 31.95,4.84 32.44,5.33 39.85,5.33 H2.17
  Bottom Layer w0.33: v1(19.89,7.99) 19.89,8.18 19.7,8.38 19.7,9.26 19.69,9.27 19.69,9.6 21.49,11.41 21.49,11.56 21.86,11.92 22.01,11.92 25.7,15.62 v1(26.16,15.62)
$1N2428: length 31.5
  Top Layer w0.33: v1(20.32,8.64) 19.64,8.64 U2.36
  Inner2 w0.33: v1(20.32,8.64) 21.62,7.34 22.37,7.34 23.3,6.41 31.11,6.41 31.44,6.08 43.37,6.08 47.37,2.07 H2.19
$1N2430: length 20.2
  Top Layer w0.33: v1(39.24,14.6) 39.24,15.09 39.31,15.16 39.31,15.66 U3.15
  Inner2 w0.33: H2.20 50.12,2.07 45.34,6.86 43.31,6.86 41.54,8.62 41.54,11.41 40.11,12.83 39.7,12.83 39.24,13.29 v1(39.24,14.6)
$1N4492: length 20.7
  Top Layer w0.33: v1(33.4,6.98) 33.4,5.46 32.51,4.57 28.63,4.57 Q1.1 ; v1(35.56,14.83) 35.84,15.12 U3.22
  Bottom Layer w0.33: v1(35.56,14.83) 35.16,14.83 33.61,13.29 33.61,8.09 33.4,7.88 v1(33.4,6.98)
$1N4593: length 5.7
  Top Layer w0.33: Q1.3 27.38,7.17 27.38,10.4 27.9,10.92 LED1.2
$1N4646: length 1.8
  Top Layer w0.33: 26.3,13.44 26.2,13.34 LED1.1

## Copper pours and planes (outline as drawn; the poured copper is in the pictures)
GND on Top Layer: -0.64,24.77 63.63,24.77 63.63,-0.13 -0.64,-0.13
GND on Bottom Layer: -0.64,24.77 63.63,24.77 63.63,-0.13 -0.64,-0.13
GND on GND: 0.26,24.13 62.48,24.13 62.48,0.26 0.26,0.26
GND on Inner2: -0.64,24.77 63.63,24.77 63.63,-0.13 -0.64,-0.13
GND on Inner3: -0.64,24.77 63.63,24.77 63.63,-0.13 -0.64,-0.13
3.3 on 3.3: 0.26,24.13 62.48,24.13 62.48,0.26 0.26,0.26

Small or netless copper shapes (teardrops, artwork), in the pictures only: 5 on Top Layer, 51 on GND, 4 on 3.3

## Text on the board
Bottom Silkscreen Layer: Up/Down Converter
Top Silkscreen Layer: OpenBeam: PAE v1 | RX | TX
